# EAGLE design hat (EAGLE 9.4.2)
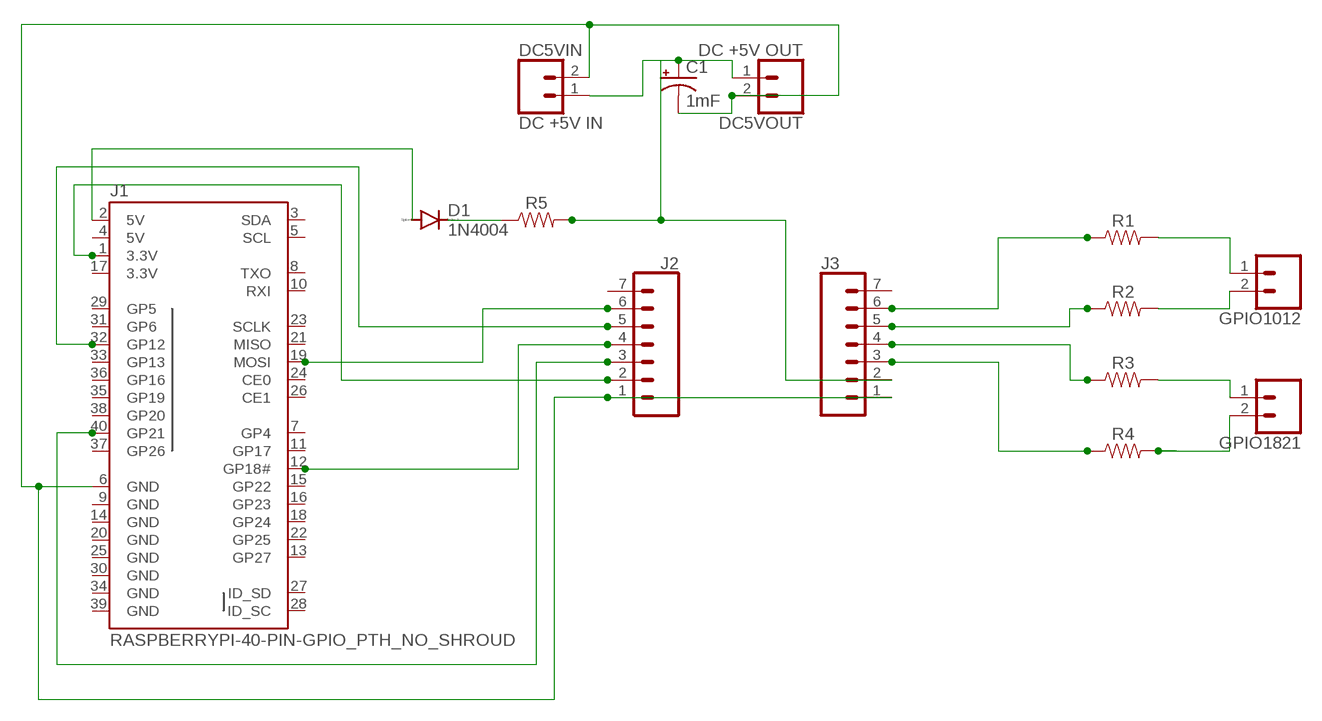
[diagram p0: schematic, sheet 1]

## Parts
C1  1mF  1000UF-RADIAL-5MM-25V-20%  [CPOL-RADIAL-5MM-10MM]
D1  1N4004  [DO41-10]
DC5VIN  DC +5V IN  CONN_02PTH4  [1X02_XTRA_BIG]
DC5VOUT  DC +5V OUT  CONN_02PTH4  [1X02_XTRA_BIG]
GPIO1012  CONN_02PTH4  [1X02_XTRA_BIG]
GPIO1821  CONN_02PTH4  [1X02_XTRA_BIG]
J1  RASPBERRYPI-40-PIN-GPIO_PTH_NO_SHROUD  [2X20]
J2  CONN_07  [1X07]
J3  CONN_07  [1X07]
R1  RESISTORAXIAL-0.3  [AXIAL-0.3]
R2  RESISTORAXIAL-0.3  [AXIAL-0.3]
R3  RESISTORAXIAL-0.3  [AXIAL-0.3]
R4  RESISTORAXIAL-0.3  [AXIAL-0.3]
R5  RESISTORAXIAL-0.3  [AXIAL-0.3]

## Nets
3.3V: J1.1(3.3V) J2.2
3.3VGP10: J1.19(MOSI) J2.6
3.3VGP12: J1.32(GP12) J2.5
3.3VGP18: J1.12(GP18#) J2.4
3.3VGP21: J1.40(GP21) J2.3
5V: D1.A J1.2(5V)
5VGP10: J3.6 R1.P$1
5VGP12: J3.5 R2.P$1
5VGP18: J3.4 R3.P$1
5VGP21: J3.3 R4.P$1
GND: C1.- DC5VIN.2 DC5VOUT.2 J1.6(GND) J2.1 J3.1
GP10: GPIO1012.1 R1.P$2
GP12: GPIO1012.2 R2.P$2
GP18: GPIO1821.1 R3.P$2
GP21: GPIO1821.2 R4.P$2
N$5: D1.C R5.P$1
N$6: C1.+ DC5VIN.1 DC5VOUT.1 J3.2 R5.P$2
Unconnected: J1.3(SDA) J1.5(SCL) J1.7(GP4) J1.8(TXO) J1.10(RXI) J1.11(GP17) J1.13(GP27) J1.15(GP22) J1.16(GP23) J1.18(GP24) J1.21(MISO) J1.22(GP25) J1.23(SCLK) J1.24(CE0) J1.26(CE1) J1.27(ID_SD) J1.28(ID_SC) J1.29(GP5) J1.31(GP6) J1.33(GP13) J1.35(GP19) J1.36(GP16) J1.37(GP26) J1.38(GP20) J2.7 J3.7

## Power pins joined to a net without a drawn wire
3.3V: J1.17(3.3V)
5V: J1.4(5V)
GND: J1.9(GND) J1.14(GND) J1.20(GND) J1.25(GND) J1.30(GND) J1.34(GND) J1.39(GND)

## Library data of the parts
C1 = SparkFun-Capacitors:1000UF: 1,000µF/1mF ceramic capacitors A capacitor is a passive two-terminal electrical component used to store electrical energy temporarily in an electric field. CAP-08070; PROD_ID: CAP-09538
D1 = diode:1N4004: DIODE general purpose rectifier, 1 A
DC5VIN DC5VOUT GPIO1012 GPIO1821 = SparkFun-Connectors:CONN_02: Multi connection point. Often used as Generic Header-pin footprint for 0.1 inch spaced/style header connections On any of the 0.1 inch spaced packages, you can populate with these: Break Away Headers - Straight <https://www.sparkfun.com/products/116> (PRT-00116) Break Away Male Headers - Right Angle <https://www.sparkfun.com/products/553> (PRT-00553) Female Headers <https://www.sparkfun.com/products/115> (PRT-00115) Break Away Headers - Machine Pin <https://www.sparkfun.com/products/117> (PRT-00117) Break Away Female Headers - Swiss Machine Pin <https://www.sparkfun.com/products/743> (PRT-00743) For SCREWTERMINALS and SPRING TERMINALS visit here: Screw Terimnals on SparkFun.com <https://www.sparkfun.com/search/results?term=Screw+Terminals> (5mm/3.5mm/2.54mm spacing) This device is also useful as a general connection point to wire up your design to another part of your project. Our various solder wires solder well into these plated through hole pads. Hook-Up Wire - Assortment (Stranded, 22 AWG) <https://www.sparkfun.com/products/11375> (PRT-11375) Hook-Up Wire - Assortment (Solid Core, 22 AWG) <https://www.sparkfun.com/products/11367> (PRT-11367) View the entire wire category on our website here <https://www.sparkfun.com/categories/141> Special notes: Molex polarized connector foot print use with: PRT-08233 with associated crimp pins and housings. 2.54_SCREWTERM for use with PRT-10571. 3.5mm Screw Terminal footprints for PRT-08084 5mm Screw Terminal footprints for use with PRT-08432
J1 = SparkFun-Connectors:RASPBERRYPI-40-PIN-GPIO: Raspberry Pi GPIO Header 2x20 pin connector, as found on B, B+, A+ models. Both shrouded PTH and SMT versions available. SparkFun Products: GPIO Shrouded Header <https://www.sparkfun.com/products/13054>- PTH SparkFun Pi Wedge (Preassembled) <https://www.sparkfun.com/products/13717>
J2 J3 = SparkFun-Connectors:CONN_07: Multi connection point. Often used as Generic Header-pin footprint for 0.1 inch spaced/style header connections On any of the 0.1 inch spaced packages, you can populate with these: Break Away Headers - Straight <https://www.sparkfun.com/products/116> (PRT-00116) Break Away Male Headers - Right Angle <https://www.sparkfun.com/products/553> (PRT-00553) Female Headers <https://www.sparkfun.com/products/115> (PRT-00115) Break Away Headers - Machine Pin <https://www.sparkfun.com/products/117> (PRT-00117) Break Away Female Headers - Swiss Machine Pin <https://www.sparkfun.com/products/743> (PRT-00743) For SCREWTERMINALS and SPRING TERMINALS visit here: Screw Terimnals on SparkFun.com <https://www.sparkfun.com/search/results?term=Screw+Terminals> (5mm/3.5mm/2.54mm spacing) This device is also useful as a general connection point to wire up your design to another part of your project. Our various solder wires solder well into these plated through hole pads. Hook-Up Wire - Assortment (Stranded, 22 AWG) <https://www.sparkfun.com/products/11375> (PRT-11375) Hook-Up Wire - Assortment (Solid Core, 22 AWG) <https://www.sparkfun.com/products/11367> (PRT-11367) View the entire wire category on our website here <https://www.sparkfun.com/categories/141> Special notes: Molex polarized connector foot print use with SKU : PRT-08231 with associated crimp pins and housings. 1MM SMD Version SKU: PRT-10208 NOTES ON THE VARIANTS LOCK and LOCK_LONGPADS... This footprint was designed to help hold the alignment of a through-hole component (i.e. 6-pin header) while soldering it into place. You may notice that each hole has been shifted either up or down by 0.005 of an inch from it's more standard position (which is a perfectly straight line). This slight alteration caused the pins (the squares in the middle) to touch the edges of the holes. Because they are alternating, it causes a "brace" to hold the component in place. 0.005 has proven to be the perfect amount of "off-center" position when using our standard breakaway headers. Although looks a little odd when you look at the bare footprint, once you have a header in there, the alteration is very hard to notice. Also,if you push a header all the way into place, it is covered up entirely on the bottom side.
R1-R5 = SparkFun-Resistors:RESISTOR: Generic Resistor Package

## Board
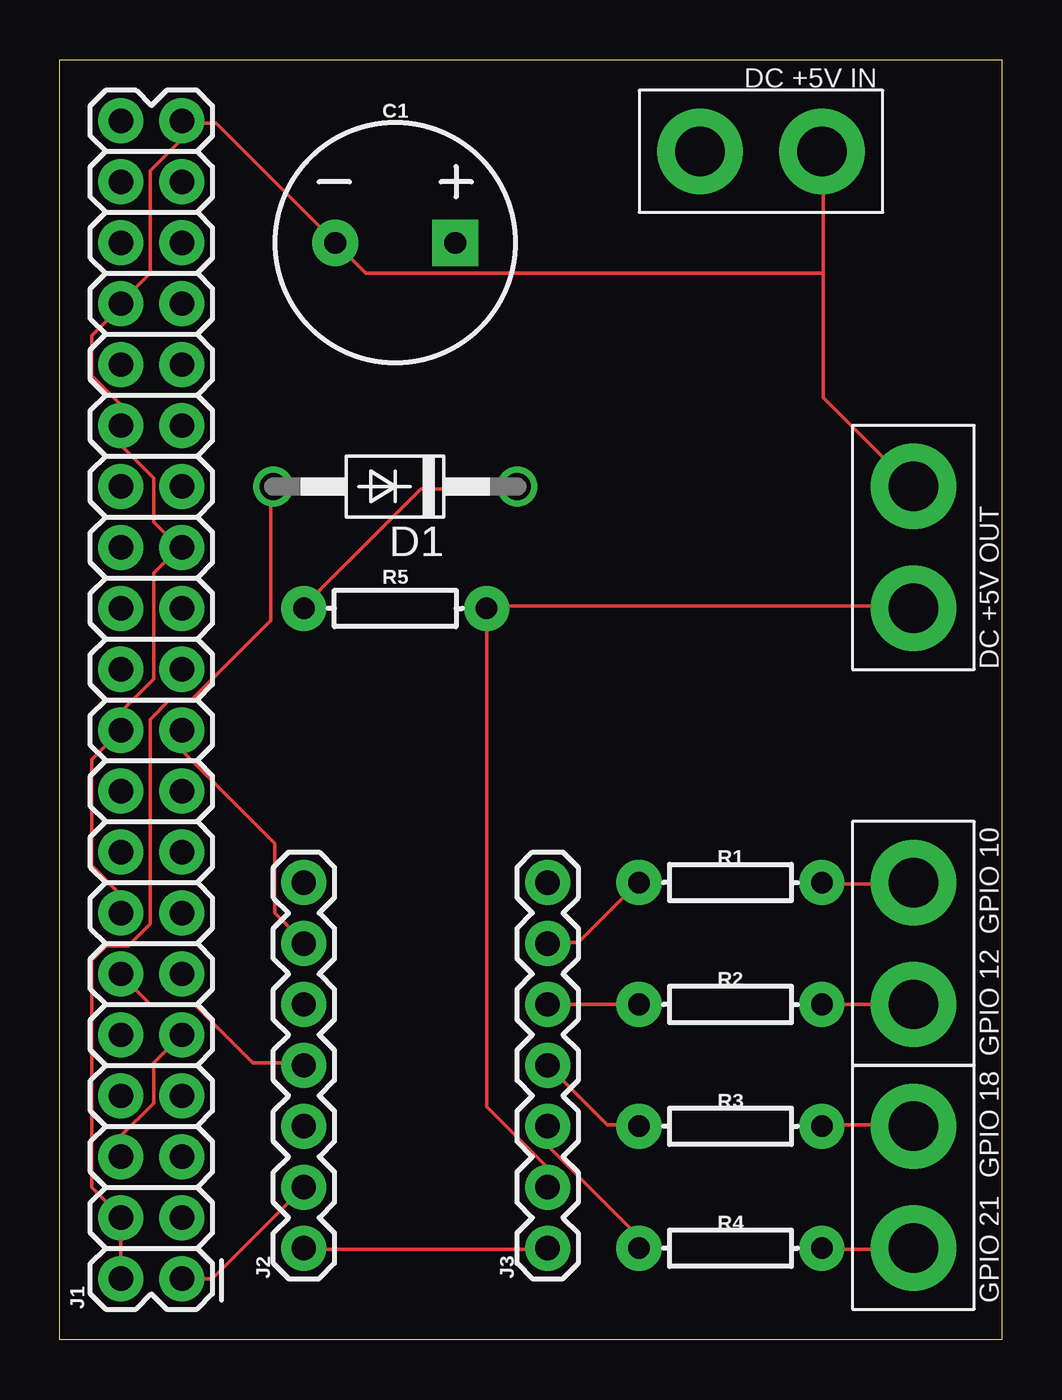
[diagram p1: board, top side]
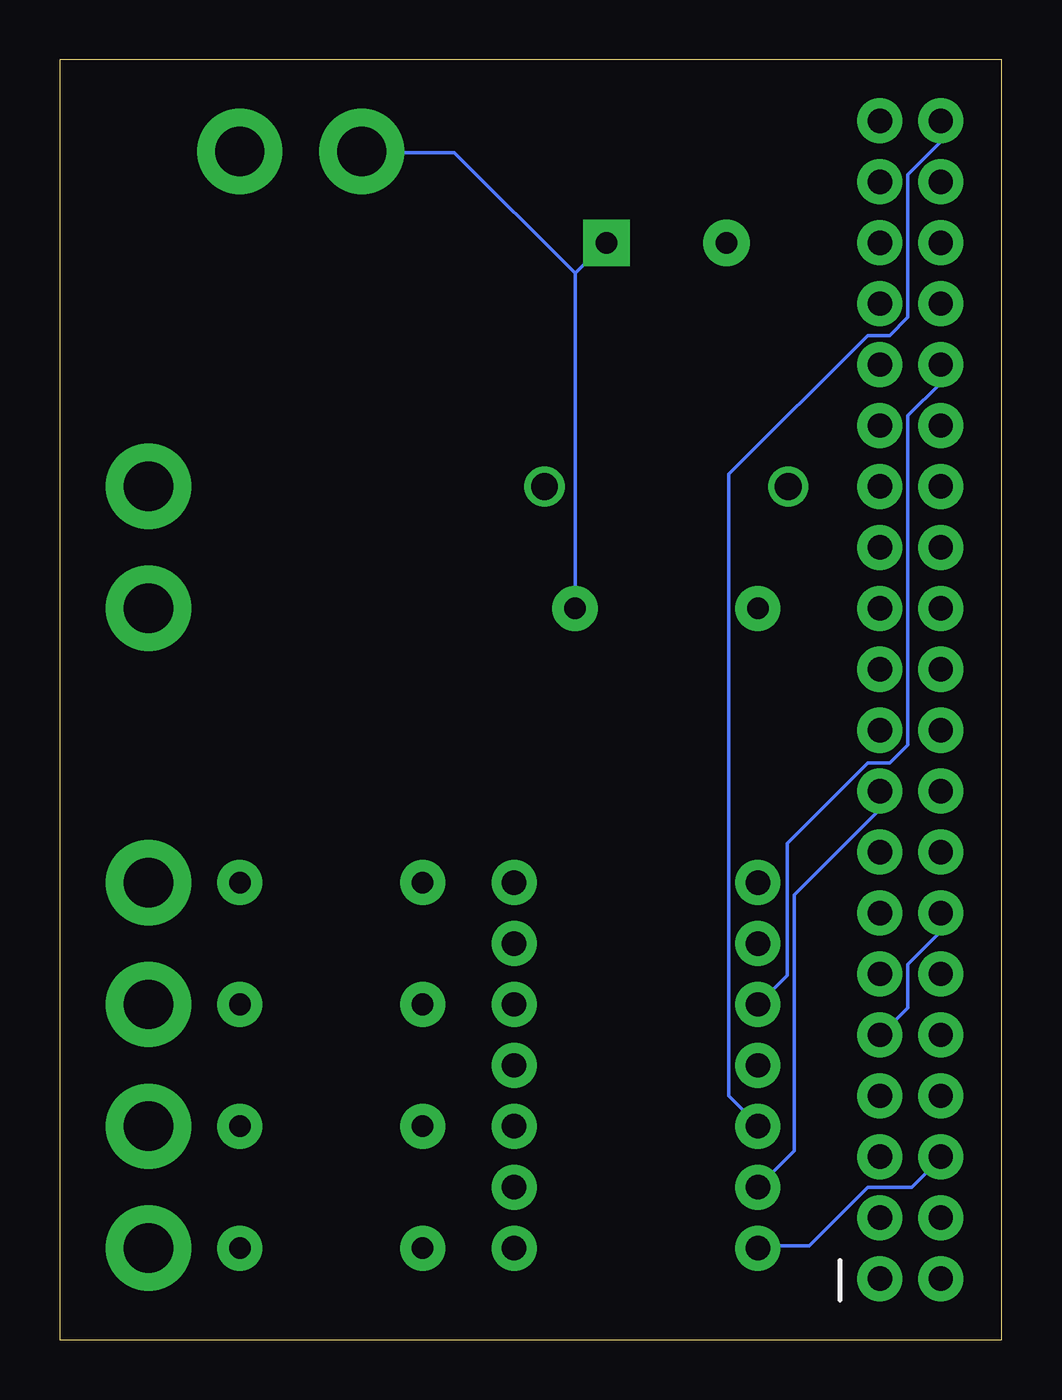
[diagram p2: board, bottom side, seen from below]

Size 39.24 x 53.34 mm. Coordinates in mm from the lower left corner, seen from the top.
Outline: 0,0 0,53.34 39.24,53.34 39.24,0 0,0
Copper layers (1*16): Top 0.035mm / dielectric 1.5mm / Bottom 0.035mm
Design rules "default *": minimum track width 6mil, minimum drill 0.35mm, track to track 6mil, track to pad 6mil, pad to pad 6mil, via to via 6mil, smd to smd 6mil, copper to edge 40mil, drill to drill 6mil, minimum pad ring 10mil, minimum via ring 8mil, stop-mask expansion 4mil, vias tented up to drill 0mil, thermal gap 10mil

### Footprints (pad centres in the part's own frame; a part is rotated, then mirrored left to right if it is on the bottom)
CPOL-RADIAL-5MM-10MM = drill 0.9 pad 1.93 square: + 2.5,0 | drill 0.9 pad 1.93: - -2.5,0
DO41-10 = drill 1.118: A 5.08,0; C -5.08,0
1X02_XTRA_BIG = drill 2.057 pad 3.556: 1 -2.54,0; 2 2.54,0
2X20 = drill 1.016 pad 1.88: 1 0,0; 2 0,2.54; 3 2.54,0; 4 2.54,2.54; 5 5.08,0; 6 5.08,2.54; 7 7.62,0; 8 7.62,2.54; 9 10.16,0; 10 10.16,2.54; 11 12.7,0; 12 12.7,2.54; 13 15.24,0; 14 15.24,2.54; 15 17.78,0; 16 17.78,2.54; 17 20.32,0; 18 20.32,2.54; 19 22.86,0; 20 22.86,2.54; 21 25.4,0; 22 25.4,2.54; 23 27.94,0; 24 27.94,2.54; 25 30.48,0; 26 30.48,2.54; 27 33.02,0; 28 33.02,2.54; 29 35.56,0; 30 35.56,2.54; 31 38.1,0; 32 38.1,2.54; 33 40.64,0; 34 40.64,2.54; 35 43.18,0; 36 43.18,2.54; 37 45.72,0; 38 45.72,2.54; 39 48.26,0; 40 48.26,2.54
1X07 = drill 1.016 pad 1.88: 1 0,0; 2 2.54,0; 3 5.08,0; 4 7.62,0; 5 10.16,0; 6 12.7,0; 7 15.24,0
AXIAL-0.3 = drill 0.9 pad 1.88: P$1 -3.81,0; P$2 3.81,0

### Placement (x,y rotation side)
C1  13.97,45.72 0 top
D1  13.97,35.56 180 top
DC5VIN  29.21,49.53 0 top
DC5VOUT  35.56,33.02 90 top
GPIO1012  35.56,16.51 270 top
GPIO1821  35.56,6.35 270 top
J1  5.08,2.54 90 top
J2  10.16,3.81 90 top
J3  20.32,3.81 90 top
R1  27.94,19.05 0 top
R2  27.94,13.97 0 top
R3  27.94,8.89 0 top
R4  27.94,3.81 0 top
R5  13.97,30.48 0 top

### Tracks (layer width: path | path; a pad name or v marks a point on that pad's centre or on a via)
3.3V
  Top 0.152: J1.1 6.35,2.54 J2.2
  Bottom 0.152: J2.2 8.64,7.87 8.64,18.54 5.13,22.05 5.13,22.81 J1.17
3.3VGP10
  Top 0.152: J1.19 5.13,25.4 5.13,24.49 8.94,20.68 8.94,17.78 10.16,16.56 J2.6
3.3VGP12
  Bottom 0.152: J1.32 2.54,39.88 3.91,38.51 3.91,24.79 4.67,24.03 5.59,24.03 8.94,20.68 8.94,15.19 J2.5
3.3VGP18
  Top 0.152: J2.4 10.16,11.53 8.03,11.53 5.59,13.97 3.76,13.97 2.54,15.19 J1.12
3.3VGP21
  Bottom 0.152: J1.40 2.54,49.94 3.91,48.57 3.91,42.62 4.67,41.86 5.59,41.86 11.38,36.07 11.38,10.16 10.16,8.94 J2.3
5V
  Top 0.152: D1.A 8.79,35.46 8.79,29.97 5.44,26.62 4.52,26.62 3.76,25.86 3.76,17.32 2.85,16.41 1.93,16.41 1.32,15.8 1.32,6.35 2.54,5.13 J1.4 J1.2
5VGP10
  Top 0.152: J3.6 20.37,16.56 21.59,16.56 24.03,19 R1.P$1
5VGP12
  Top 0.152: R2.P$1 J3.5
5VGP18
  Top 0.152: J3.4 22.81,8.94 24.03,8.94 R3.P$1
5VGP21
  Top 0.152: J3.3 20.37,8.79 20.37,8.03 24.03,4.37 24.03,3.91 R4.P$1
GND
  Top 0.152: J1.6 2.54,8.48 3.91,9.86 3.91,11.53 J1.9 | J3.1 20.22,3.76 10.16,3.76 J2.1 | 31.8,44.45 31.8,39.27 35.46,35.61 DC5VOUT.2 | 31.8,44.45 31.8,49.48 DC5VIN.2 | 4.98,33.02 3.91,31.95 3.91,27.53 2.54,26.16 J1.20 1.32,24.18 1.32,19.76 2.54,18.54 J1.14 | 4.98,33.02 3.91,34.09 3.91,35.92 2.54,37.29 J1.30 2.54,38.96 1.32,40.18 1.32,41.86 2.54,43.08 J1.34 2.54,43.23 3.76,44.45 3.76,48.72 4.98,49.94 4.98,50.7 J1.39 5.13,50.7 6.5,50.7 11.38,45.82 C1.- 11.53,45.67 12.75,44.45 31.8,44.45 | 4.98,33.02 J1.25
  Bottom 0.152: J1.14 2.54,17.02 3.91,15.65 3.91,13.82 4.98,12.75 J1.9 | J2.1 10.16,3.91 8.03,3.91 5.59,6.35 3.76,6.35 2.54,7.57 J1.6
GP10
  Top 0.152: R1.P$2 31.8,19 35.46,19 GPIO1012.1
GP12
  Top 0.152: GPIO1012.2 R2.P$2
GP18
  Top 0.152: R3.P$2 31.8,8.94 35.46,8.94 GPIO1821.1
GP21
  Top 0.152: R4.P$2 31.8,3.76 35.46,3.76 GPIO1821.2
N$5
  Top 0.152: D1.C 19,35.46 15.04,35.46 10.16,30.58 R5.P$1
N$6
  Top 0.152: J3.2 20.22,6.35 20.22,7.26 17.78,9.7 R5.P$2 17.78,30.58 35.46,30.58 DC5VOUT.1
  Bottom 0.152: 17.78,44.45 R5.P$2 | 17.78,44.45 16.56,45.67 C1.+ | 17.78,44.45 22.81,49.48 26.62,49.48 DC5VIN.1

### Text on the board
tNames: GPIO 10 | GPIO 12 | GPIO 18 | GPIO 21